# EAGLE design power_driver (EAGLE 5.07)
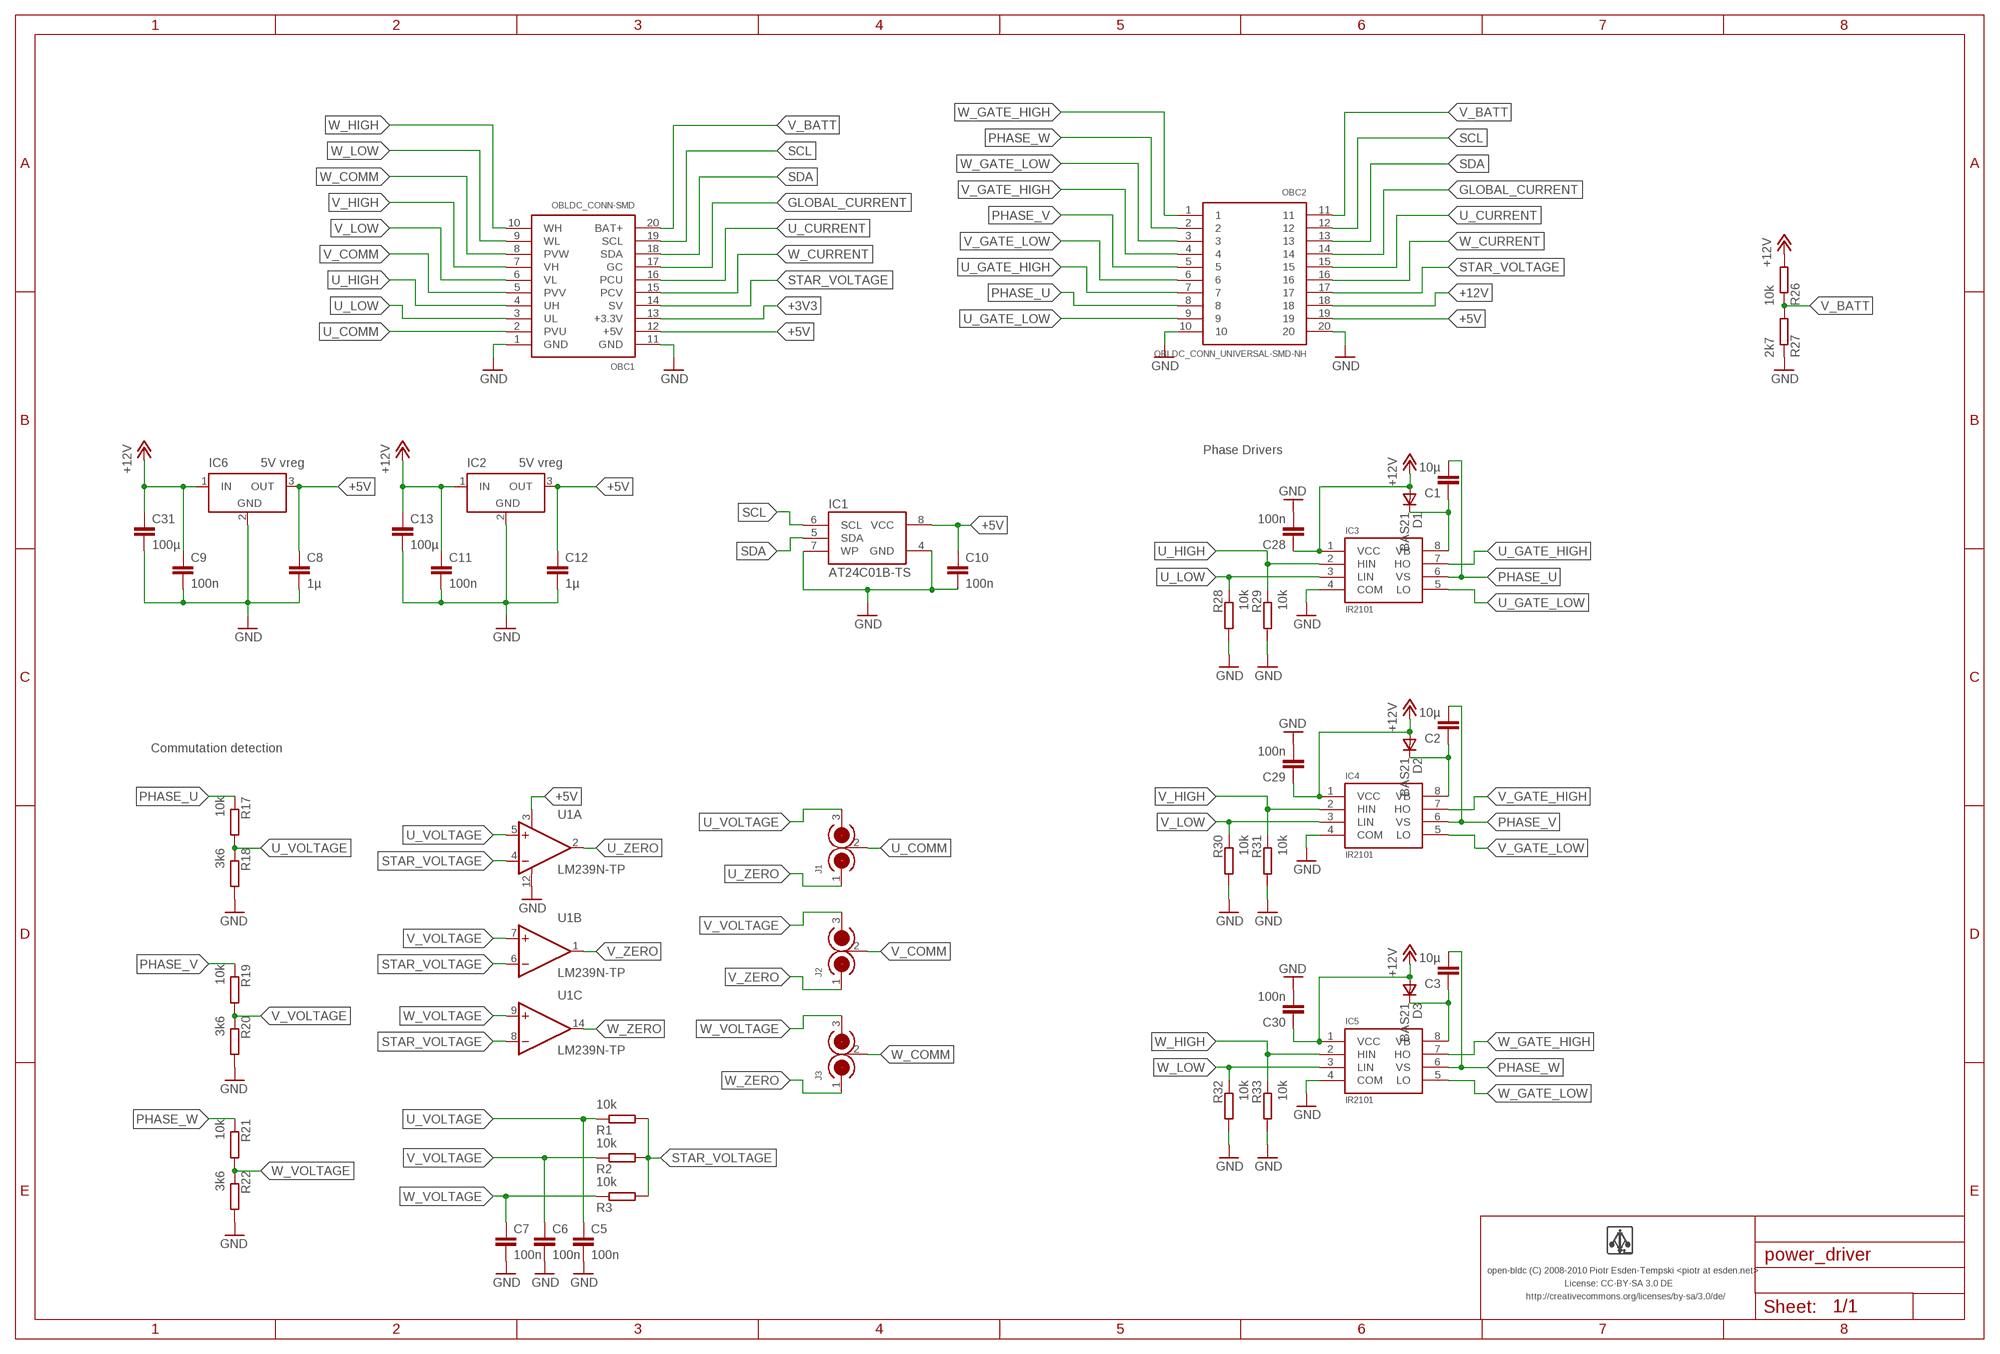
[diagram p0: schematic, sheet 1]

## Parts
C1  10µ  CAPACITOR-0603  [0603-CAP]
C2  10µ  CAPACITOR-0603  [0603-CAP]
C3  10µ  CAPACITOR-0603  [0603-CAP]
C5  100n  CAPACITOR-0603  [0603-CAP]
C6  100n  CAPACITOR-0603  [0603-CAP]
C7  100n  CAPACITOR-0603  [0603-CAP]
C8  1µ  CAPACITOR-0603  [0603-CAP]
C9  100n  CAPACITOR-0603  [0603-CAP]
C10  100n  CAPACITOR-0603  [0603-CAP]
C11  100n  CAPACITOR-0603  [0603-CAP]
C12  1µ  CAPACITOR-0603  [0603-CAP]
C13  100µ  CAPACITOR-0603  [0603-CAP]
C28  100n  CAPACITOR-0603  [0603-CAP]
C29  100n  CAPACITOR-0603  [0603-CAP]
C30  100n  CAPACITOR-0603  [0603-CAP]
C31  100µ  CAPACITOR-0603  [0603-CAP]
D1  BAS21  VAR2SOT23  [SOT-23]
D2  BAS21  VAR2SOT23  [SOT-23]
D3  BAS21  VAR2SOT23  [SOT-23]
IC1  AT24C01B-TS  [TSSOP8]
IC2  5V vreg  LT1129CST5  [SOT223]
IC3  IR2101  [SO-8]
IC4  IR2101  [SO-8]
IC5  IR2101  [SO-8]
IC6  5V vreg  LT1129CST5  [SOT223]
J1  CIRC_JMP_2  [CIRC_JMP_2]
J2  CIRC_JMP_2  [CIRC_JMP_2]
J3  CIRC_JMP_2  [CIRC_JMP_2]
OBC1  OBLDC_CONN-SMD  [OBLDC_CONN_SMD]
OBC2  OBLDC_CONN_UNIVERSAL-SMD-NH  [OBLDC_CONN_SMD_NO_HOLES]
R1  10k  RESISTOR-0603  [0603-RES]
R2  10k  RESISTOR-0603  [0603-RES]
R3  10k  RESISTOR-0603  [0603-RES]
R17  10k  RESISTOR-0603  [0603-RES]
R18  3k6  RESISTOR-0603  [0603-RES]
R19  10k  RESISTOR-0603  [0603-RES]
R20  3k6  RESISTOR-0603  [0603-RES]
R21  10k  RESISTOR-0603  [0603-RES]
R22  3k6  RESISTOR-0603  [0603-RES]
R26  10k  RESISTOR-0603  [0603-RES]
R27  2k7  RESISTOR-0603  [0603-RES]
R28  10k  RESISTOR-0603  [0603-RES]
R29  10k  RESISTOR-0603  [0603-RES]
R30  10k  RESISTOR-0603  [0603-RES]
R31  10k  RESISTOR-0603  [0603-RES]
R32  10k  RESISTOR-0603  [0603-RES]
R33  10k  RESISTOR-0603  [0603-RES]
U1  LM239N-TP  [TSSOP_14]
U$1  LOGO-NORM  [LOGO]

## Nets
+3V3: OBC1.13(+3.3V)
+5V: C8.P$1 C10.P$1 C12.P$1 IC1.8(VCC) IC2.3(OUT) IC6.3(OUT) OBC1.12(+5V) OBC2.19 U1.3(A:V+)
+12V: C9.P$1 C11.P$1 C13.P$1 C28.P$1 C29.P$1 C30.P$1 C31.P$1 D1.3(A) D2.3(A) D3.3(A) IC2.1(IN) IC3.1(VCC) IC4.1(VCC) IC5.1(VCC) IC6.1(IN) OBC2.18 R26.P$2
GLOBAL_CURRENT: OBC1.17(GC) OBC2.14
GND: C5.P$2 C6.P$2 C7.P$2 C8.P$2 C9.P$2 C10.P$2 C11.P$2 C12.P$2 C13.P$2 C28.P$2 C29.P$2 C30.P$2 C31.P$2 IC1.4(GND) IC1.7(WP) IC2.2(GND) IC3.4(COM) IC4.4(COM) IC5.4(COM) IC6.2(GND) OBC1.1(GND) OBC1.11(GND) OBC2.10 OBC2.20 R18.P$2 R20.P$2 R22.P$2 R27.P$1 R28.P$2 R29.P$2 R30.P$2 R31.P$2 R32.P$2 R33.P$2 U1.12(A:V-)
N$12: C1.P$1 D1.1(C) IC3.8(VB)
N$16: C2.P$1 D2.1(C) IC4.8(VB)
N$21: C3.P$1 D3.1(C) IC5.8(VB)
PHASE_U: C1.P$2 IC3.6(VS) OBC2.8 R17.P$1
PHASE_V: C2.P$2 IC4.6(VS) OBC2.5 R19.P$1
PHASE_W: C3.P$2 IC5.6(VS) OBC2.2 R21.P$1
SCL: IC1.6(SCL) OBC1.19(SCL) OBC2.12
SDA: IC1.5(SDA) OBC1.18(SDA) OBC2.13
STAR_VOLTAGE: OBC1.14(SV) OBC2.17 R1.P$2 R2.P$2 R3.P$2 U1.4(A:-IN) U1.6(B:-IN) U1.8(C:-IN)
U_COMM: J1.2 OBC1.2(PVU)
U_CURRENT: OBC1.16(PCU) OBC2.15
U_GATE_HIGH: IC3.7(HO) OBC2.7
U_GATE_LOW: IC3.5(LO) OBC2.9
U_HIGH: IC3.2(HIN) OBC1.4(UH) R29.P$1
U_LOW: IC3.3(LIN) OBC1.3(UL) R28.P$1
U_VOLTAGE: C5.P$1 J1.3 R1.P$1 R17.P$2 R18.P$1 U1.5(A:+IN)
U_ZERO: J1.1 U1.2(A:OUT)
V_BATT: OBC1.20(BAT+) OBC2.11 R26.P$1 R27.P$2
V_COMM: J2.2 OBC1.5(PVV)
V_GATE_HIGH: IC4.7(HO) OBC2.4
V_GATE_LOW: IC4.5(LO) OBC2.6
V_HIGH: IC4.2(HIN) OBC1.7(VH) R31.P$1
V_LOW: IC4.3(LIN) OBC1.6(VL) R30.P$1
V_VOLTAGE: C6.P$1 J2.3 R2.P$1 R19.P$2 R20.P$1 U1.7(B:+IN)
V_ZERO: J2.1 U1.1(B:OUT)
W_COMM: J3.2 OBC1.8(PVW)
W_CURRENT: OBC1.15(PCV) OBC2.16
W_GATE_HIGH: IC5.7(HO) OBC2.1
W_GATE_LOW: IC5.5(LO) OBC2.3
W_HIGH: IC5.2(HIN) OBC1.10(WH) R33.P$1
W_LOW: IC5.3(LIN) OBC1.9(WL) R32.P$1
W_VOLTAGE: C7.P$1 J3.3 R3.P$1 R21.P$2 R22.P$1 U1.9(C:+IN)
W_ZERO: J3.1 U1.14(C:OUT)
Unconnected: U1.10(D:-IN) U1.11(D:+IN) U1.13(D:OUT)

## Notes on the sheet
- Phase Drivers
- Commutation detection
- open-bldc (C) 2008-2010 Piotr Esden-Tempski <piotr at esden.net>
- License: CC-BY-SA 3.0 DE
- http://creativecommons.org/licenses/by-sa/3.0/de/

## Power pins joined to a net without a drawn wire
GND: IC2.4(GND) IC6.4(GND)

## Library data of the parts
C1-C3 C5-C13 C28-C31 = pel_dipol_comp:CAPACITOR
D1-D3 = zetex:VAR2SOT23: DIODE
IC1 = open-bldc:AT24C01B
IC2 IC6 = linear-technology:LT1129CST5: VOLTAGE REGULATOR with shutdown
IC3-IC5 = open-bldc:IR2101
J1-J3 = fancy_jumpers:CIRC_JMP_2
OBC1 = open-bldc:OBLDC_CONN
OBC2 = open-bldc:OBLDC_CONN_UNIVERSAL
R1-R3 R17-R22 R26-R33 = pel_dipol_comp:RESISTOR
U1 = open-bldc:LM239N
U$1 = open-bldc:LOGO

## Net classes
0 default: width 0.152 mm, drill 0.305 mm, clearance 0.152 mm

## Board
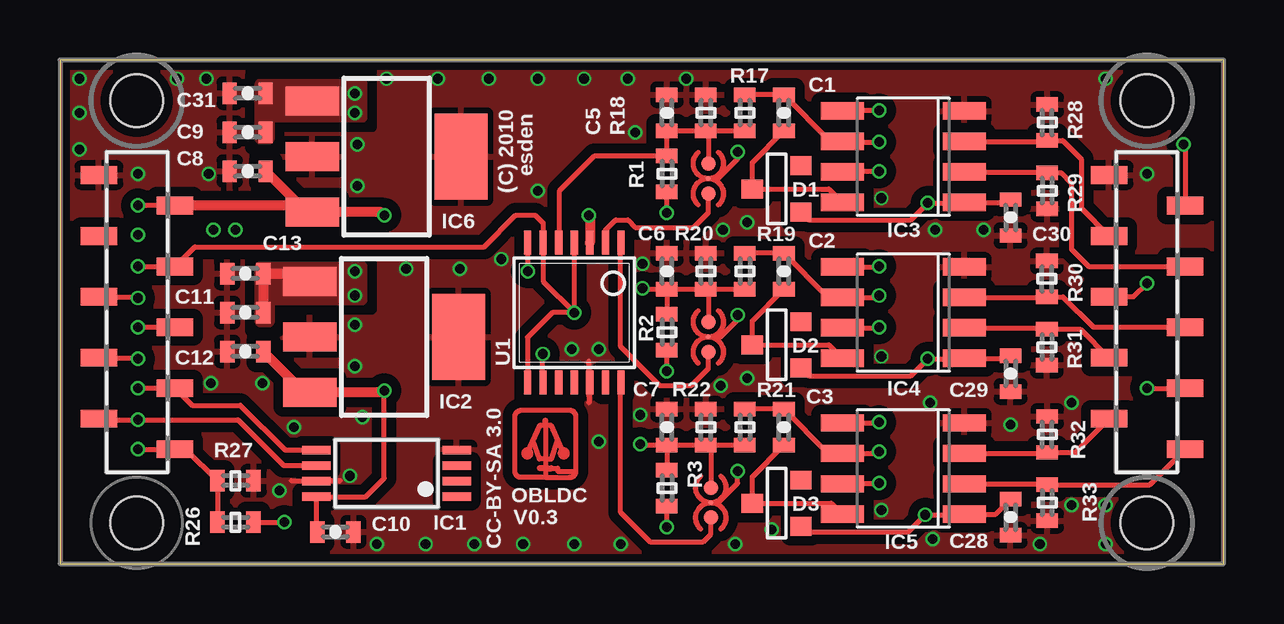
[diagram p1: board, top side]
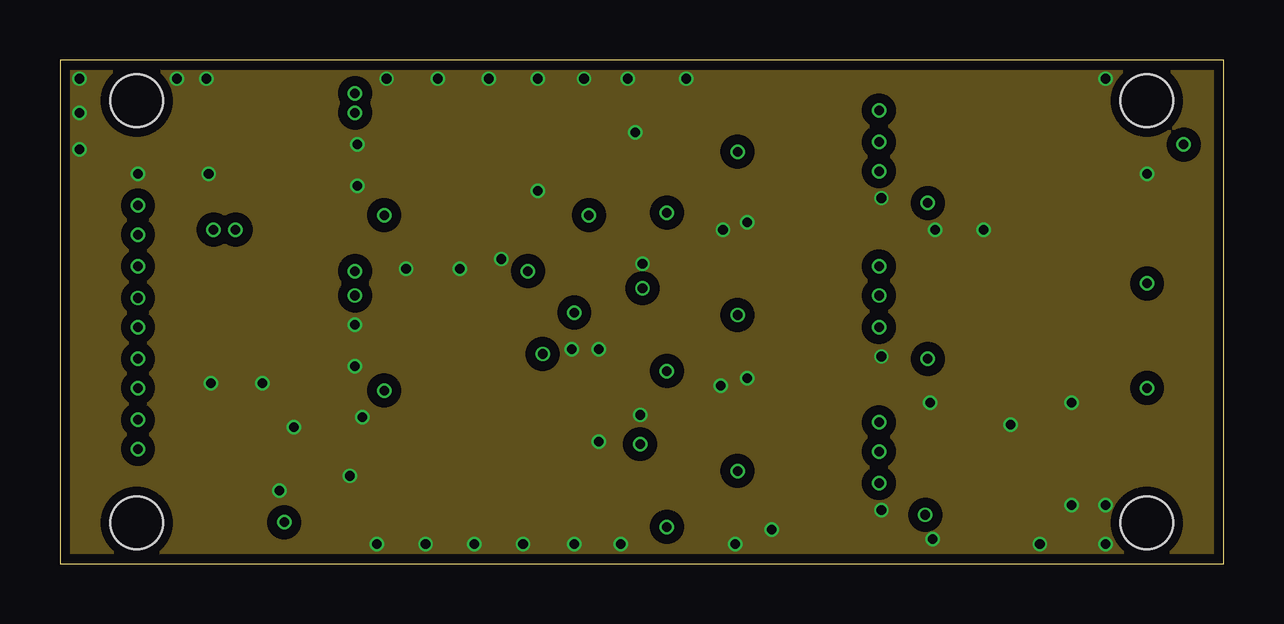
[diagram p2: board, inner layer Route2]
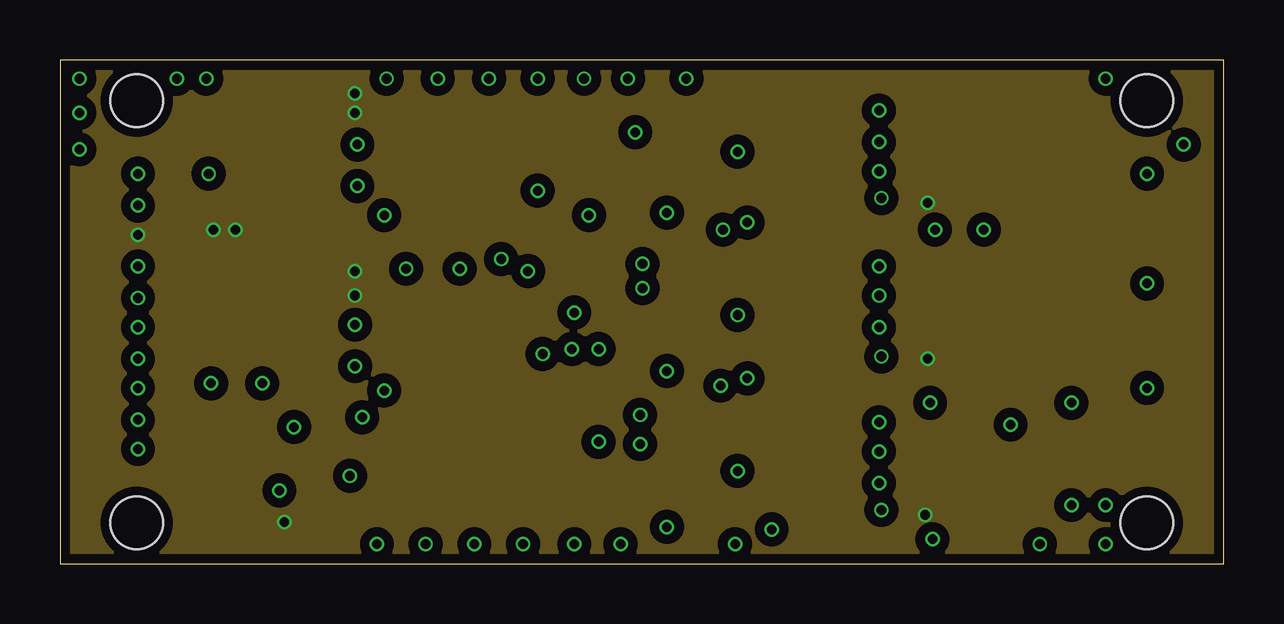
[diagram p3: board, inner layer Route15]
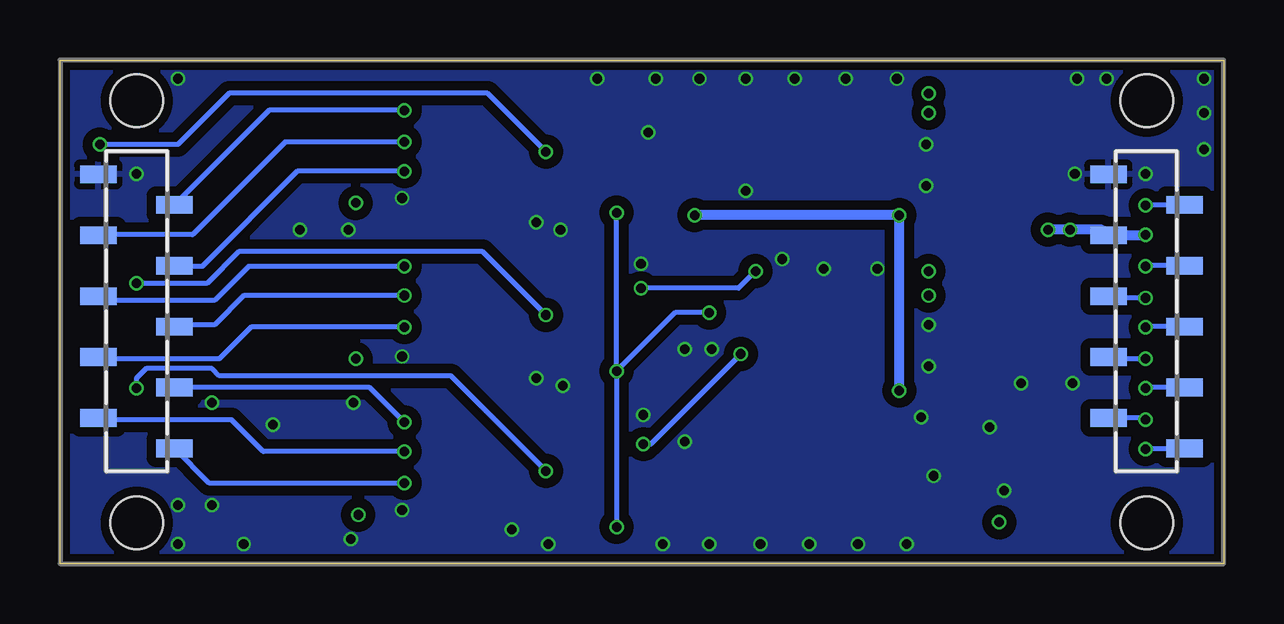
[diagram p4: board, bottom side, seen from below]

Size 48.5 x 21 mm. Coordinates in mm from the lower left corner, seen from the top.
Outline: 48.5,0 48.5,21 0,21 0,0 48.5,0
Copper layers (1*2+15*16): Top 0.035mm / dielectric 1.5mm / Route2 0.035mm / dielectric 0.15mm / Route15 0.035mm / dielectric 0.2mm / Bottom 0.035mm
Design rules "open-bldc *": minimum track width 8mil, minimum drill 0.4mm, track to track 8mil, track to pad 8mil, pad to pad 8mil, via to via 8mil, smd to smd 8mil, copper to edge 10mil, drill to drill 8mil, minimum pad ring 8mil, minimum via ring 0.1mm, stop-mask expansion 4mil, vias tented up to drill 0.4mm, thermal gap 10mil

### Footprints (pad centres in the part's own frame; a part is rotated, then mirrored left to right if it is on the bottom)
0603-CAP = smd 0.6 x 0.9: P$1 -0.75,0; P$2 0.75,0
SOT-23 = smd 0.787 x 0.889: 1 0.025,-1.016; 2 -0.94,1.016; 3 0.991,1.016
TSSOP8 = smd 1.2 x 0.35: 1 -2.925,0.975; 2 -2.925,0.325; 3 -2.925,-0.325; 4 -2.925,-0.975; 5 2.925,-0.975; 6 2.925,-0.325; 7 2.925,0.325; 8 2.925,0.975
SOT223 = smd 1.219 x 2.235: 1 -2.311,-3.099; 2 0,-3.099; 3 2.311,-3.099 | smd 3.6 x 2.2: 4 0,3.099
SO-8 = smd 0.72 x 1.78: 1 -1.905,-2.543; 2 -0.635,-2.543; 3 0.635,-2.543; 4 1.905,-2.543; 5 1.905,2.543; 6 0.635,2.543; 7 -0.635,2.543; 8 -1.905,2.543
CIRC_JMP_2 = smd 0.61 x 0.61: 1 0,-0.617; 3 0,0.617 | smd 0.203 x 0.203: 2 0,0
OBLDC_CONN_SMD = smd 1.525 x 0.74: 1 43.727,16.2; 2 46.903,14.93; 3 43.727,13.66; 4 46.903,12.39; 5 43.727,11.12; 6 46.903,9.85; 7 43.727,8.58; 8 46.903,7.31; 9 43.727,6.04; 10 46.903,4.77; 11 1.624,16.2; 12 4.799,14.93; 13 1.624,13.66; 14 4.799,12.39; 15 1.624,11.12; 16 4.799,9.85; 17 1.624,8.58; 18 4.799,7.31; 19 1.624,6.04; 20 4.799,4.77 | hole 2.2: 45.3,1.7; 45.3,19.3; 3.2,1.7; 3.2,19.3
OBLDC_CONN_SMD_NO_HOLES = smd 1.525 x 0.74: 1 43.727,16.2; 2 46.903,14.93; 3 43.727,13.66; 4 46.903,12.39; 5 43.727,11.12; 6 46.903,9.85; 7 43.727,8.58; 8 46.903,7.31; 9 43.727,6.04; 10 46.903,4.77; 11 1.624,16.2; 12 4.799,14.93; 13 1.624,13.66; 14 4.799,12.39; 15 1.624,11.12; 16 4.799,9.85; 17 1.624,8.58; 18 4.799,7.31; 19 1.624,6.04; 20 4.799,4.77
0603-RES = smd 0.6 x 0.9: P$1 -0.75,0; P$2 0.75,0
TSSOP_14 = smd 0.305 x 0.991: 1 -1.95,-2.918; 2 -1.3,-2.918; 3 -0.65,-2.918; 4 0,-2.918; 5 0.65,-2.918; 6 1.3,-2.918; 7 1.95,-2.918; 8 1.95,2.918; 9 1.3,2.918; 10 0.65,2.918; 11 0,2.918; 12 -0.65,2.918; 13 -1.3,2.918; 14 -1.95,2.918

### Placement (x,y rotation side)
C1  30.18,18.8 90 top
C2  30.18,12.19 90 top
C3  30.18,5.69 90 top
C5  25.3,18.8 90 top
C6  25.3,12.19 90 top
C7  25.3,5.69 90 top
C8  7.82,16.36 180 top
C9  7.82,17.98 180 top
C10  11.48,1.32 0 top
C11  7.72,10.46 180 top
C12  7.72,8.84 180 top
C13  7.72,12.09 180 top
C28  39.62,1.93 270 top
C29  39.62,7.92 270 top
C30  39.62,14.43 270 top
C31  7.82,19.61 180 top
D1  29.87,15.65 270 top
D2  29.87,9.14 270 top
D3  29.87,2.54 270 top
IC1  13.61,3.76 180 top
IC2  13.51,9.45 270 top
IC3  35.15,16.97 90 top
IC4  35.15,10.46 90 top
IC5  35.15,3.96 90 top
IC6  13.61,16.97 270 top
J1  27.03,16.05 0 top
J2  27.03,9.45 0 top
J3  27.13,2.54 0 top
OBC1  0,0 0 top
OBC2  0,21 180 bottom
R1  25.3,16.26 270 top
R2  25.3,9.65 270 top
R3  25.3,3.15 270 top
R17  28.55,18.8 270 top
R18  26.92,18.8 90 top
R19  28.55,12.19 270 top
R20  26.92,12.19 90 top
R21  28.55,5.69 270 top
R22  26.92,5.69 90 top
R26  7.32,1.73 0 top
R27  7.32,3.45 180 top
R28  41.15,18.39 90 top
R29  41.15,15.54 270 top
R30  41.13,11.87 90 top
R31  41.13,9.03 270 top
R32  41.15,5.38 90 top
R33  41.15,2.54 270 top
U1  21.44,10.46 180 top
U$1  20.22,4.88 0 top

### Tracks (layer width: path | path; a pad name or v marks a point on that pad's centre or on a via)
+5V  (via drill 0.4)
  Top 0.203: C10.P$1 10.69,1.36 IC1.8 12.74,2.78 13.51,3.56 v13.51,7.21 | v3.25,14.94 OBC1.12
  Top 0.406: U1.3 22.09,14.49 v22.05,14.53 | C8.P$1 10.28,14.66 IC6.3 | OBC1.12 10.24,14.93 IC6.3 | 10.17,7.14 IC2.3 | 10.17,7.14 C12.P$1 | IC6.3 13.39,14.66 v13.51,14.53 | 10.17,7.14 13.44,7.14 v13.51,7.21
  Bottom 0.203: OBC2.19 3.23,14.96 v3.25,14.94
  Bottom 0.406: v22.05,14.53 v13.51,14.53 v13.51,7.21
+12V  (via drill 0.4)
  Top 0.203: C29.P$1 39.51,8.56 IC4.1 37.67,8.53 v36.17,8.53 35.46,7.82 31.22,7.82 D2.3 | C30.P$1 39.51,15.06 IC3.1 37.67,15.04 v36.17,15.04 35.46,14.33 31.22,14.33 D1.3 | D3.3 31.11,1.32 35.36,1.32 v36.07,2.03 37.67,2.03 IC5.1 39,2.06 C28.P$1 | R26.P$2 v9.35,1.73
  Top 0.406: IC2.1 10.08,12.09 C13.P$1 C11.P$1
  Bottom 0.406: OBC2.18 3.28,13.69 v3.25,13.72 | 4.88,13.72 5.08,13.92 v7.32,13.92
  other vias: 12.29,18.8 12.29,19.61 12.29,11.18 12.29,12.19 6.4,13.92
  pour Route15 (isolate 0.406, rank 2): 48.5,0 0,0 0,21 48.5,21
  pour Top (no thermals): 8.33,20.02 12.6,20.02 12.6,18.59 8.74,18.59 8.74,17.68 8.33,17.68
  pour Top (no thermals): 8.33,12.4 12.6,12.4 12.6,10.97 8.74,10.97 8.74,10.06 8.33,10.06
GLOBAL_CURRENT  (via drill 0.4)
  Top 0.203: OBC1.17 3.21,8.58 v3.25,8.53
  Bottom 0.203: v3.25,8.53 4.72,8.53 OBC2.14
GND  (via drill 0.4)
  Top 0.203: 22.05,7.01 22.05,6.71 | 22.05,7.01 22.05,8.43 | U1.12 22.09,7.05 22.05,7.01 | 9.65,3.45 11.68,3.45 10.71,3.45 IC1.7
  other vias: 45.31,16.26 38.51,13.92 36.47,13.92 27.64,13.92 28.65,14.22 24.28,12.5 27.53,7.42 28.65,7.72 36.27,6.71 39.62,5.79 42.16,6.71 24.18,6.2 21.34,8.94 22.45,8.94 42.16,2.44 43.59,2.44 43.59,0.81 40.84,0.81 28.14,0.81 29.67,1.42 36.37,1.02 0.81,20.22 0.81,18.8 0.81,17.27 4.88,20.22 6.1,20.22 6.2,16.26 3.25,16.26 13.61,20.22 15.75,20.22 17.88,20.22 19.91,20.22 21.84,20.22 23.67,20.22 26.11,20.22 6.3,7.52 8.43,7.52 9.75,5.69 12.6,6.1 12.09,3.66 9.14,3.05 13.21,0.81 15.24,0.81 17.27,0.81 19.3,0.81 21.44,0.81 23.37,0.81 14.43,12.29 16.66,12.29 18.39,12.7 22.45,5.08 12.4,17.48 12.4,15.75 12.29,9.96 12.29,8.23 19.91,15.54 23.98,17.98 43.59,20.22 34.24,15.24 34.24,8.64 34.24,2.24
  pour Bottom (isolate 0.406, rank 2): 48.5,0 0,0 0,21 48.5,21
  pour Top (isolate 0.406, rank 2): 48.5,0 0,0 0,21 48.5,21
  pour Route2 (isolate 0.406, rank 2): 48.5,0 0,0 0,21 48.5,21
N$12
  Top 0.203: IC3.8 32.05,15.62 D1.1 28.85,16.73 C1.P$1
N$16
  Top 0.203: IC4.8 32.05,9.12 D2.1 28.85,10.12 C2.P$1
N$21
  Top 0.203: IC5.8 32.15,2.52 D3.1 28.85,3.62 C3.P$1
PHASE_U  (via drill 0.4)
  Top 0.203: v34.14,17.58 32.64,17.58 IC3.6 32.12,17.6 C1.P$2 R17.P$1
  Bottom 0.203: v34.14,17.58 39.12,17.58 42.98,13.72 46.88,13.72 OBC2.8
PHASE_V  (via drill 0.4)
  Top 0.203: v34.14,11.18 34.06,11.1 IC4.6 32.02,11.1 C2.P$2 R19.P$1
  Bottom 0.203: v34.14,11.18 40.84,11.18 42.06,9.96 43.65,9.96 OBC2.5
PHASE_W  (via drill 0.4)
  Top 0.203: v34.14,4.67 34.06,4.6 IC5.6 32.02,4.6 C3.P$2 R21.P$1
  Bottom 0.203: v34.14,4.67 40.03,4.67 41.35,5.99 46.83,5.99 OBC2.2
SCL  (via drill 0.4)
  Top 0.203: IC1.6 9.33,4.08 7.42,5.99 v3.25,5.99 1.67,5.99 OBC1.19
  Bottom 0.203: OBC2.12 3.33,6.07 v3.25,5.99
SDA  (via drill 0.4)
  Top 0.203: OBC1.18 | IC1.5 9.39,4.73 7.52,6.6 5.51,6.6 OBC1.18 | v3.25,7.32 OBC1.18
  Bottom 0.203: OBC2.13 3.23,7.34 v3.25,7.32
STAR_VOLTAGE  (via drill 0.4)
  Top 0.203: v25.3,8.03 R2.P$2 | v25.3,14.63 R1.P$2 | v25.3,1.52 R3.P$2 | v21.44,10.46 U1.4 | v21.44,10.46 20.14,11.77 U1.6 20.14,14.2 19.81,14.53 19,14.53 17.68,13.21 5.62,13.21 OBC1.14 v3.25,12.39 | U1.8 19.49,9.43 20.52,10.46 v21.44,10.46
  Bottom 0.203: v25.3,8.03 v25.3,14.63 | v25.3,8.03 v25.3,1.52 | v25.3,8.03 22.86,10.46 v21.44,10.46 | OBC2.17 3.23,12.42 v3.25,12.39
U_COMM  (via drill 0.4)
  Top 0.203: J1.2 27.43,16.05 28.25,16.87 v28.25,17.17 | v46.84,17.48 46.9,17.41 OBC1.2
  Bottom 0.203: v28.25,17.17 30.68,19.61 41.45,19.61 43.59,17.48 v46.84,17.48
U_CURRENT  (via drill 0.4)
  Top 0.203: v3.25,9.86 OBC1.16
  Bottom 0.203: OBC2.15 3.23,9.88 v3.25,9.86
U_GATE_HIGH  (via drill 0.4)
  Top 0.203: IC3.7 32.64,16.36 v34.14,16.36
  Bottom 0.203: v34.14,16.36 38.61,16.36 42.57,12.39 43.7,12.39 OBC2.7
U_GATE_LOW  (via drill 0.4)
  Top 0.203: IC3.5 32.64,18.9 v34.14,18.9
  Bottom 0.203: v34.14,18.9 39.79,18.9 OBC2.9
U_HIGH
  Top 0.203: OBC1.4 42.88,12.39 42.16,13.11 42.16,15.85 41.72,16.3 R29.P$1 41.11,16.33 IC3.2
U_LOW
  Top 0.203: OBC1.3 42.57,14.82 42.57,16.87 41.8,17.64 R28.P$1 41.11,17.6 IC3.3
U_VOLTAGE
  Top 0.203: R18.P$1 R17.P$2 | R18.P$1 C5.P$1 R1.P$1 22.29,17.01 20.83,15.54 20.83,13.42 U1.5 | R18.P$1 27.03,17.94 J1.3
U_ZERO
  Top 0.203: J1.1 27.03,14.63 26.42,14.02 23.98,14.02 23.67,14.33 23.16,14.33 22.74,13.9 U1.2
V_BATT  (via drill 0.4)
  Top 0.203: R26.P$1 R27.P$2 5.25,4.77 OBC1.20 v3.26,4.77 v3.25,4.78
  Bottom 0.203: v3.25,4.78 1.65,4.78 OBC2.11
V_COMM  (via drill 0.4)
  Top 0.203: J2.2 27.53,9.45 28.25,10.16 v28.25,10.36 | v45.31,11.68 44.75,11.12 OBC1.5
  Bottom 0.203: v28.25,10.36 30.89,13.01 41.05,13.01 42.37,11.68 v45.31,11.68
V_GATE_HIGH  (via drill 0.4)
  Top 0.203: IC4.7 34.11,9.83 v34.14,9.86
  Bottom 0.203: v34.14,9.86 40.54,9.86 41.86,8.53 46.83,8.53 OBC2.4
V_GATE_LOW  (via drill 0.4)
  Top 0.203: IC4.5 34.11,12.37 v34.14,12.39
  Bottom 0.203: v34.14,12.39 40.64,12.39 42.06,10.97 46.73,10.97 OBC2.6 46.88,11.18
V_HIGH
  Top 0.203: OBC1.7 42.53,9.78 R31.P$1 41.08,9.83 IC4.2
V_LOW
  Top 0.203: OBC1.6 43.08,9.86 41.81,11.12 R30.P$1 41.11,11.1 IC4.3
V_VOLTAGE  (via drill 0.4)
  Top 0.203: R20.P$1 R19.P$2 | C6.P$1 R20.P$1 | C6.P$1 25.3,11.38 | R20.P$1 27.03,11.34 J2.3 | C6.P$1 R2.P$1 | C6.P$1 24.32,11.44 v24.28,11.48 | v19.51,12.19 19.51,13.36 U1.7
  Bottom 0.203: v24.28,11.48 20.22,11.48 v19.51,12.19
V_ZERO
  Top 0.203: J2.1 27.03,8.13 26.31,7.42 24.99,7.42 23.37,9.04 23.37,13.36 U1.1
W_COMM  (via drill 0.4)
  Top 0.203: J3.2 27.43,2.54 28.25,3.35 v28.25,3.86 | v45.31,7.32 v45.32,7.31 OBC1.8
  Bottom 0.203: v28.25,3.86 32.21,7.82 41.86,7.82 42.16,8.13 44.91,8.13 45.31,7.72 v45.31,7.32
W_CURRENT  (via drill 0.4)
  Top 0.203: OBC1.15 3.21,11.12 v3.25,11.07
  Bottom 0.203: v3.25,11.07 4.72,11.07 OBC2.16
W_GATE_HIGH  (via drill 0.4)
  Top 0.203: IC5.7 32.64,3.35 v34.14,3.35
  Bottom 0.203: v34.14,3.35 42.28,3.35 OBC2.1
W_GATE_LOW  (via drill 0.4)
  Top 0.203: IC5.5 34.11,5.87 v34.14,5.89
  Bottom 0.203: v34.14,5.89 35.59,7.34 OBC2.3
W_HIGH
  Top 0.203: OBC1.10 45.42,3.29 R33.P$1 41.11,3.33 IC5.2
W_LOW
  Top 0.203: OBC1.9 42.32,4.63 R32.P$1 41.11,4.6 IC5.3
W_VOLTAGE  (via drill 0.4)
  Top 0.203: R22.P$1 R21.P$2 | C7.P$1 R22.P$1 | C7.P$1 R3.P$1 | R22.P$1 27.13,4.74 J3.3 | C7.P$1 24.22,4.94 v24.18,4.98 | v20.12,8.74 20.12,7.57 U1.9
  Bottom 0.203: v24.18,4.98 23.88,4.98 v20.12,8.74
W_ZERO
  Top 0.203: J3.1 27.13,1.22 26.82,0.91 24.59,0.91 23.37,2.13 23.37,7.53 U1.14

### Text on the board
tPlace: esden | (C) 2010 | OBLDC | V0.3 | CC-BY-SA 3.0